# Altium schematic sheet Controller.SchDoc: Controller Section
size 420 x 297 mm; SheetNumber: 2
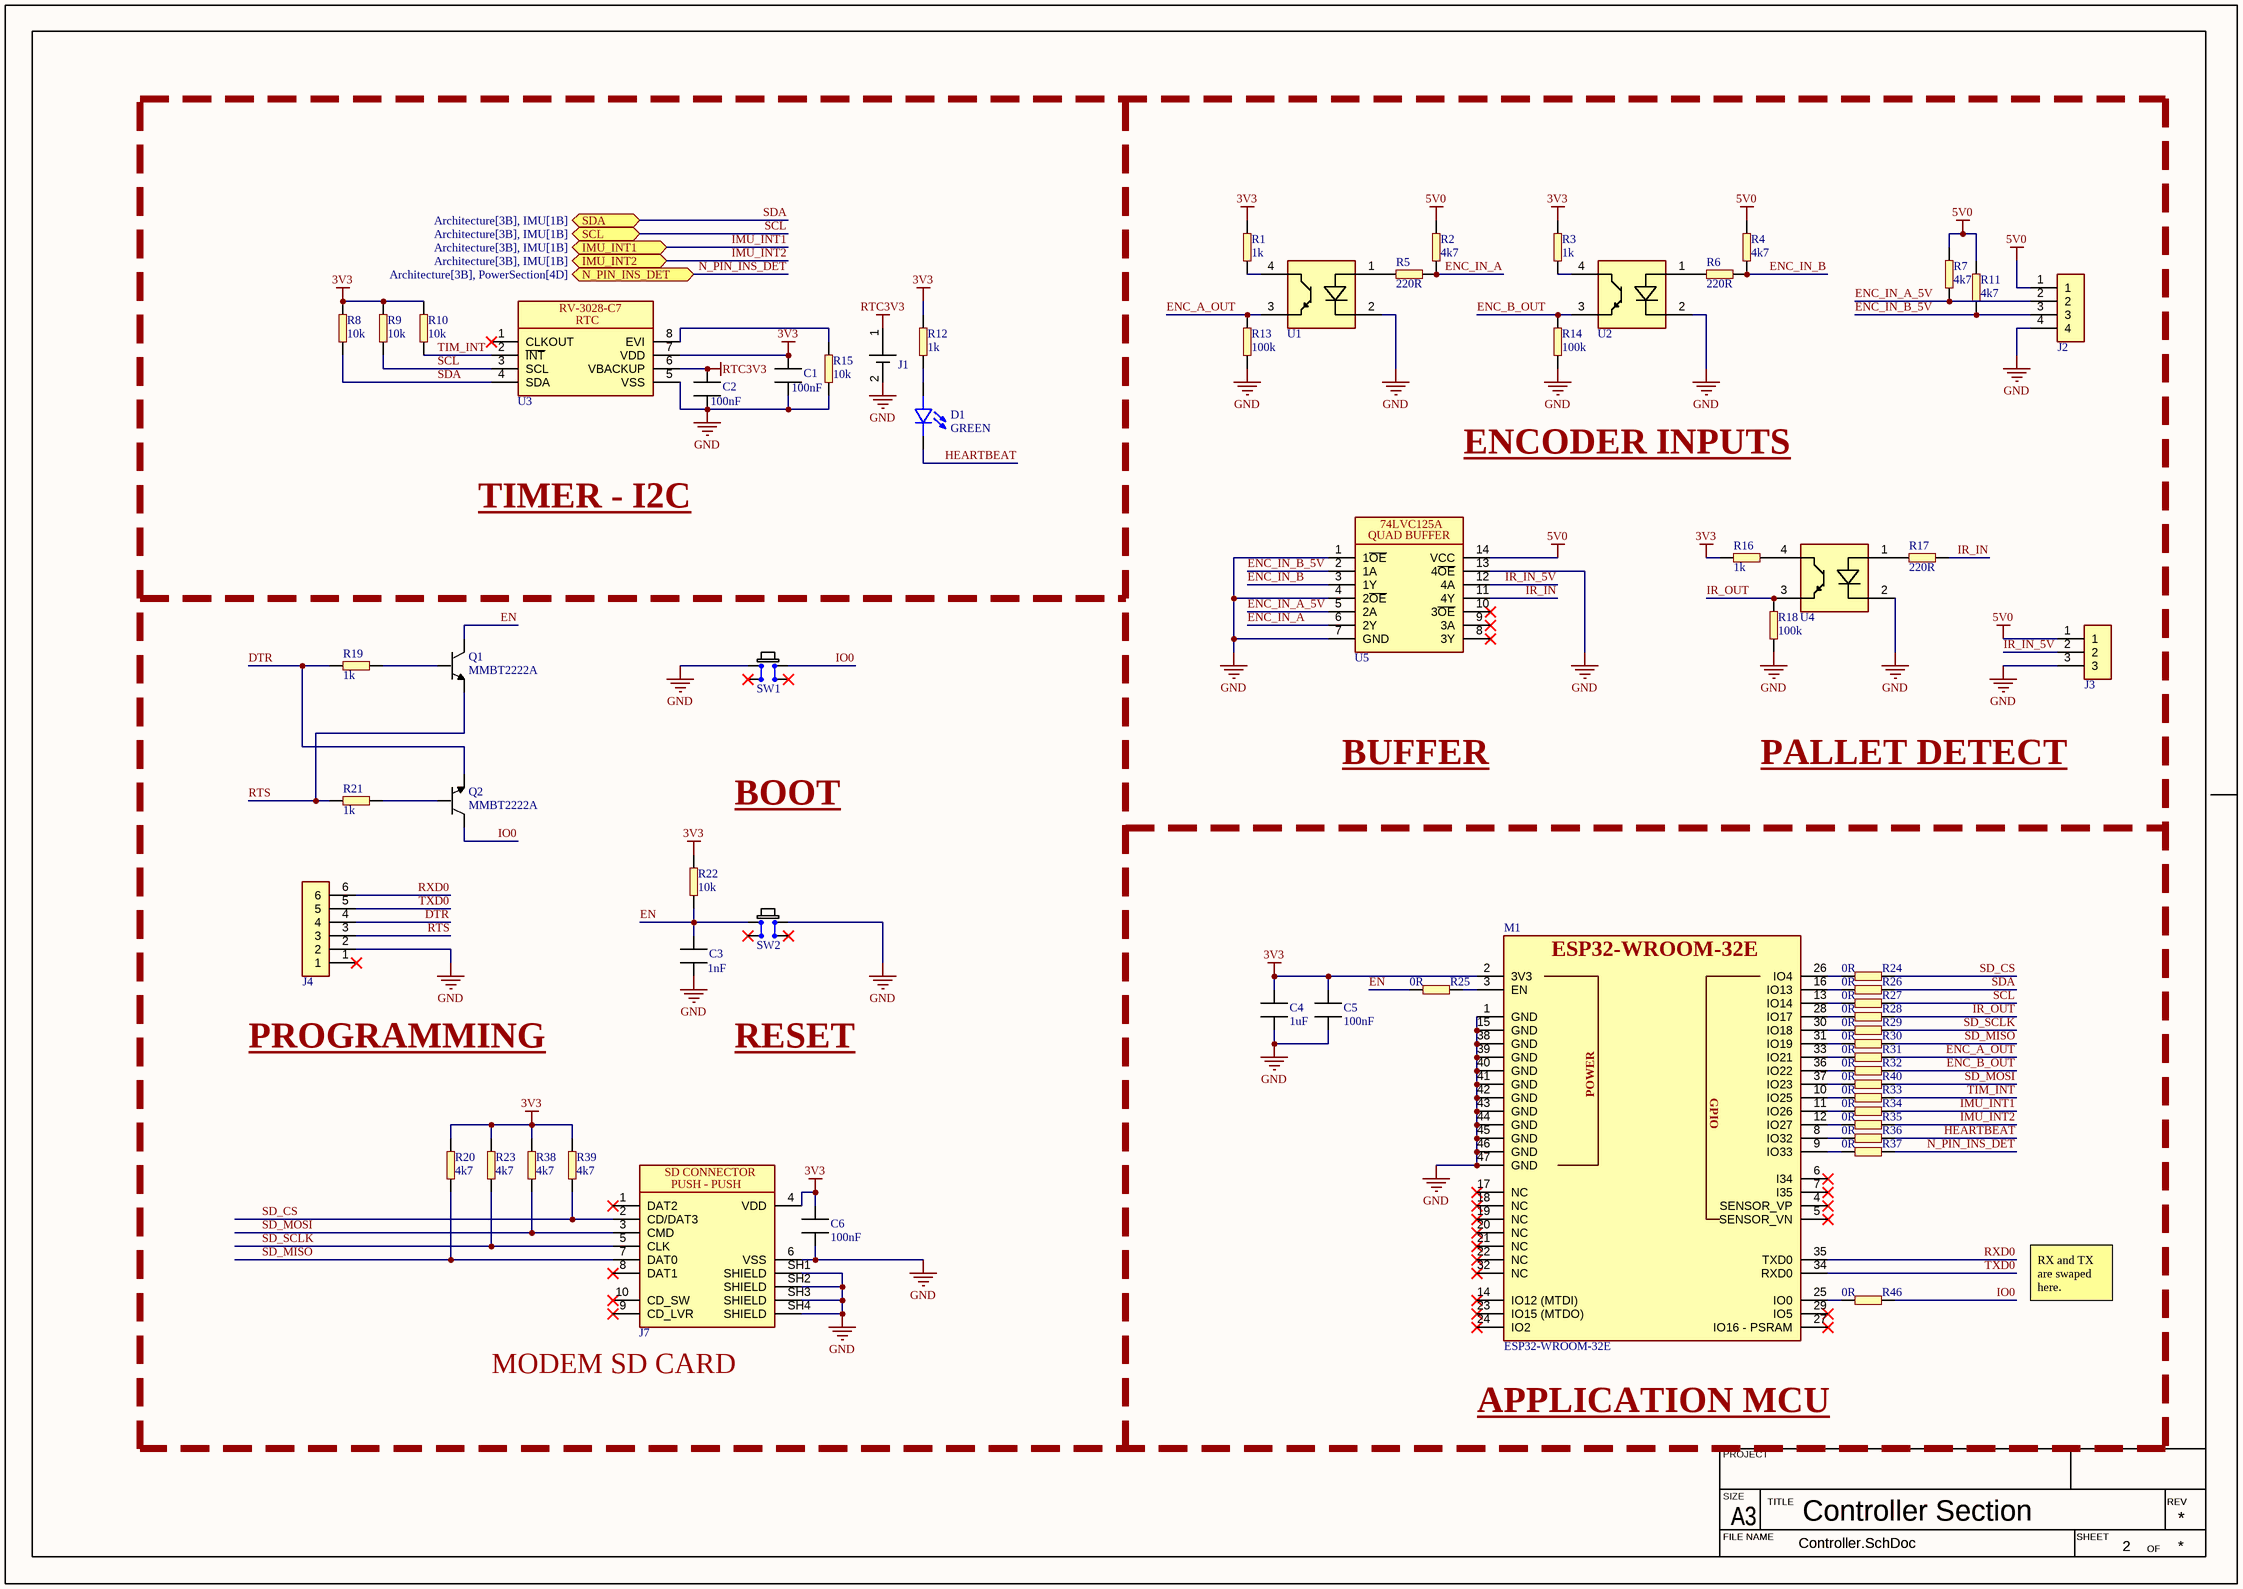
[diagram p0: Controller.SchDoc]

## Parts
C1  value 100nF  [CAPC1608X10N]  (hidden comment: ERP_102-1)
C2  value 100nF  [CAPC1608X10N]  (hidden comment: ERP_102-1)
C3  value 1nF  [CAPC1608X10N]  (hidden comment: ERP_102-1)  (no BOM)
C4  value 1uF  [CAPC1608X10N]  (hidden comment: ERP_102-1)
C5  value 100nF  [CAPC1608X10N]  (hidden comment: ERP_102-1)
C6  value 100nF  [CAPC1608X10N]  (hidden comment: ERP_102-1)
D1  value GREEN  [LED_3MM_GREEN_RIGHT_ANGLE]  (hidden comment: LED_3MM_RIGHT_ANGLE)
J1  CR1220-BH  [CR1220-BH]  (value not drawn)
J2  Terminal_Block_4Pin_5.08P  [TB_PLUG_5.08P_4P]  (value not drawn)
J3  Terminal_Block_3Pin_5.08P  [TB_PLUG_5.08P_3P]  (value not drawn)
J4  ERP_148-2  [6PX1R_F]  (value not drawn)
J7  5033981892  [5033981892]  (value not drawn)
M1  ESP32-WROOM-32E  [ESP32-WROOM-32UE]
Q1  value MMBT2222A  [MMBT2222]  (hidden comment: ERP_105-1)
Q2  value MMBT2222A  [MMBT2222]  (hidden comment: ERP_105-1)
R1  value 1k  [RES_0603]  (hidden comment: ERP_101-1)
R2  value 4k7  [RES_0603]  (hidden comment: ERP_101-1)
R3  value 1k  [RES_0603]  (hidden comment: ERP_101-1)
R4  value 4k7  [RES_0603]  (hidden comment: ERP_101-1)
R5  value 220R  [RES_0603]  (hidden comment: ERP_101-1)
R6  value 220R  [RES_0603]  (hidden comment: ERP_101-1)
R7  value 4k7  [RES_0603]  (hidden comment: ERP_101-1)
R8  value 10k  [RES_0603]  (hidden comment: ERP_101-1)
R9  value 10k  [RES_0603]  (hidden comment: ERP_101-1)
R10  value 10k  [RES_0603]  (hidden comment: ERP_101-1)
R11  value 4k7  [RES_0603]  (hidden comment: ERP_101-1)
R12  value 1k  [RES_0603]  (hidden comment: ERP_101-1)
R13  value 100k  [RES_0603]  (hidden comment: ERP_101-1)
R14  value 100k  [RES_0603]  (hidden comment: ERP_101-1)
R15  value 10k  [RES_0603]  (hidden comment: ERP_101-1)
R16  value 1k  [RES_0603]  (hidden comment: ERP_101-1)
R17  value 220R  [RES_0603]  (hidden comment: ERP_101-1)
R18  value 100k  [RES_0603]  (hidden comment: ERP_101-1)
R19  value 1k  [RES_0603]  (hidden comment: ERP_101-1)
R20  value 4k7  [RES_0603]  (hidden comment: ERP_101-1)
R21  value 1k  [RES_0603]  (hidden comment: ERP_101-1)
R22  value 10k  [RES_0603]  (hidden comment: ERP_101-1)
R23  value 4k7  [RES_0603]  (hidden comment: ERP_101-1)
R24  value 0R  [RES_0603]  (hidden comment: ERP_101-1)
R25  value 0R  [RES_0603]  (hidden comment: ERP_101-1)
R26  value 0R  [RES_0603]  (hidden comment: ERP_101-1)
R27  value 0R  [RES_0603]  (hidden comment: ERP_101-1)
R28  value 0R  [RES_0603]  (hidden comment: ERP_101-1)
R29  value 0R  [RES_0603]  (hidden comment: ERP_101-1)
R30  value 0R  [RES_0603]  (hidden comment: ERP_101-1)
R31  value 0R  [RES_0603]  (hidden comment: ERP_101-1)
R32  value 0R  [RES_0603]  (hidden comment: ERP_101-1)
R33  value 0R  [RES_0603]  (hidden comment: ERP_101-1)
R34  value 0R  [RES_0603]  (hidden comment: ERP_101-1)
R35  value 0R  [RES_0603]  (hidden comment: ERP_101-1)
R36  value 0R  [RES_0603]  (hidden comment: ERP_101-1)
R37  value 0R  [RES_0603]  (hidden comment: ERP_101-1)
R38  value 4k7  [RES_0603]  (hidden comment: ERP_101-1)
R39  value 4k7  [RES_0603]  (hidden comment: ERP_101-1)
R40  value 0R  [RES_0603]  (hidden comment: ERP_101-1)
R46  value 0R  [RES_0603]  (hidden comment: ERP_101-1)
SW1  Generic6X6  [Generic6X6]  (value not drawn)
SW2  Generic6X6  [Generic6X6]  (value not drawn)
U1  FOD817A3SD  [FOD817A3SD]  (value not drawn)
U2  FOD817A3SD  [FOD817A3SD]  (value not drawn)
U3  RV-3028-C7  [RV-3028-C7]  (value not drawn)
U4  FOD817A3SD  [FOD817A3SD]  (value not drawn)
U5  74LVC125A  [SOIC127P600X175-14M]  (value not drawn)

## Ports
IMU_INT1 (bidir, see Architecture[3B], IMU[1B]), IMU_INT2 (bidir, see Architecture[3B], IMU[1B]), N_PIN_INS_DET (bidir, see Architecture[3B], PowerSection[4D]), SCL (bidir, see Architecture[3B], IMU[1B]), SDA (bidir, see Architecture[3B], IMU[1B])

## Nets
3V3: C1.1 C4.2 C5.2 C6.2 J7.4(VDD) M1.2(3V3) R1.2 R3.2 R8.2 R9.2 R10.2 R12.1 R16.2 R20.2 R22.2 R23.2 R38.2 R39.2 U3.7(VDD)
5V0: J2.1 J3.1 R2.2 R4.2 R7.1 R11.1 U5.14(VCC)
GND: C1.2 C2.2 C3.2 C4.1 C5.1 C6.1 J1.2(-) J2.4 J3.3 J4.2 J7.6(VSS) J7.SH1(SHIELD) J7.SH2(SHIELD) J7.SH3(SHIELD) J7.SH4(SHIELD) M1.1(GND) M1.15(GND) M1.38(GND) M1.39(GND) M1.40(GND) M1.41(GND) M1.42(GND) M1.43(GND) M1.44(GND) M1.45(GND) M1.46(GND) M1.47(GND) R13.1 R14.1 R15.1 R18.1 SW1.1(NO) SW2.1(NO) U1.2(CATHODE) U2.2(CATHODE) U3.5(VSS) U4.2(CATHODE) U5.1(1~{OE}) U5.4(2~{OE}) U5.7(GND) U5.13(4~{OE})
RTC3V3: C2.1 J1.1(+) U3.6(VBACKUP)
DTR: J4.4 Q2.2 R19.2
EN: C3.1 Q1.3 R22.1 R25.2 SW2.3(COM)
ENC_A_OUT: R13.2 R31.1 U1.3(EMITTER)
ENC_B_OUT: R14.2 R32.1 U2.3(EMITTER)
ENC_IN_A: R2.1 R5.2 U5.6(2Y)
ENC_IN_A_5V: J2.2 R7.2 U5.5(2A)
ENC_IN_B: R4.1 R6.2 U5.3(1Y)
ENC_IN_B_5V: J2.3 R11.2 U5.2(1A)
HEARTBEAT: D1.2 R36.1
IMU_INT1: R34.1 ; port IMU_INT1
IMU_INT2: R35.2 ; port IMU_INT2
IO0: Q2.3 R46.1 SW1.3(COM)
IR_IN: R17.2 U5.11(4Y)
IR_IN_5V: J3.2 U5.12(4A)
IR_OUT: R18.2 R28.1 U4.3(EMITTER)
N_PIN_INS_DET: R37.1 ; port N_PIN_INS_DET
RTS: J4.3 Q1.2 R21.2
RXD0: J4.6 M1.35(TXD0)
SCL: R9.1 R27.1 U3.3(SCL) ; port SCL
SD_CS: J7.2(CD/DAT3) R24.1 R39.1
SD_MISO: J7.7(DAT0) R20.1 R30.1
SD_MOSI: J7.3(CMD) R38.1 R40.1
SD_SCLK: J7.5(CLK) R23.1 R29.1
SDA: R8.1 R26.1 U3.4(SDA) ; port SDA
TIM_INT: R10.1 R33.1 U3.2(~{INT})
TXD0: J4.5 M1.34(RXD0)
NetD1_1: D1.1 R12.2
NetM1_3: M1.3(EN) R25.1
NetM1_8: M1.8(IO32) R36.2
NetM1_9: M1.9(IO33) R37.2
NetM1_10: M1.10(IO25) R33.2
NetM1_11: M1.11(IO26) R34.2
NetM1_12: M1.12(IO27) R35.1
NetM1_13: M1.13(IO14) R27.2
NetM1_16: M1.16(IO13) R26.2
NetM1_25: M1.25(IO0) R46.2
NetM1_26: M1.26(IO4) R24.2
NetM1_28: M1.28(IO17) R28.2
NetM1_30: M1.30(IO18) R29.2
NetM1_31: M1.31(IO19) R30.2
NetM1_33: M1.33(IO21) R31.2
NetM1_36: M1.36(IO22) R32.2
NetM1_37: M1.37(IO23) R40.2
NetQ1_1: Q1.1 R19.1
NetQ2_1: Q2.1 R21.1
NetR1_1: R1.1 U1.4(COLLECTOR)
NetR3_1: R3.1 U2.4(COLLECTOR)
NetR5_1: R5.1 U1.1(ANODE)
NetR6_1: R6.1 U2.1(ANODE)
NetR15_2: R15.2 U3.8(EVI)
NetR16_1: R16.1 U4.4(COLLECTOR)
NetR17_1: R17.1 U4.1(ANODE)

Not connected (* = marked no-connect by the designer): J4 1*; J7 1(DAT2)* 8(DAT1)* 9(CD_LVR)* 10(CD_SW)*; M1 4(SENSOR_VP)* 5(SENSOR_VN)* 6(I34)* 7(I35)* 14(IO12_(MTDI))* 17(NC)* 18(NC)* 19(NC)* 20(NC)* 21(NC)* 22(NC)* 23(IO15_(MTDO))* 24(IO2)* 27(IO16_-_PSRAM)* 29(IO5)* 32(NC)*; SW1 2(NO)* 4(COM)*; SW2 2(NO)* 4(COM)*; U3 1(CLKOUT)*; U5 8(3Y)* 9(3A)* 10(3~{OE})*

## Notes on the sheet
- ENCODER INPUTS
- TIMER - I2C
- BUFFER
- PALLET DETECT
- BOOT
- PROGRAMMING
- RESET
- RX and TX are swaped here.
- (near J7) MODEM SD CARD
- APPLICATION MCU
- PROJECT
- SIZE
- FILE NAME
- A3
- TITLE
- SHEET
- OF
- REV
- (in symbol 74LVC125A) QUAD BUFFER
- (in symbol 5033981892) SD CONNECTOR; PUSH - PUSH
- (in symbol ESP32-WROOM-32E) POWER; GPIO
- (in symbol RV-3028-C7) RTC

## Library data of the parts
C1 C2 = MLCC_0603: MLCC 0603; Package: 0603; Manufacturer Part Number 1: *; Suuplier Part Number 1: *; ERP: *
  C2: Manufacturer 1: *
C3 = MLCC_0603: MLCC 0603; Manufacturer 1: Samsung Electro-Mechanics; Manufacturer Part Number 1: CL10C102JB8NNNC; Package: 0603; Suuplier Part Number 1: *; ERP: *; Supplier 1: Digikey; Supplier Part Number 1: 1276-1091-1-ND
C4-C6 = MLCC_0603: MLCC 0603; Manufacturer 1: Samsung Electro-Mechanics; Manufacturer Part Number 1: CL10A105KB8NNNC; Package: 0603; Supplier 1: *; Suuplier Part Number 1: *; ERP: *
D1 = LED_3MM_RIGHT_ANGLE: LED_3MM
J1 = CR1220-BH: BATTERY HOLDER COIN 12.5MM SMD; Manufacturer 1: Keystone Electronics; Value: *; Manufacturer Part Number 1: *
J2 = Terminal_Block_4Pin_5.08P: 6PINS TERMINAL BLOCK 5.08 PITCH; Manufacturer Part Number 1: *; Manufacturer 1: *; Supplier Part Number 1: *; Supplier 1: *; ERP: *; Package: 6PIN
J3 = Terminal_Block_3Pin_5.08P: 6PINS TERMINAL BLOCK 5.08 PITCH; Manufacturer Part Number 1: *; Manufacturer 1: *; Supplier Part Number 1: *; Supplier 1: *; ERP: *; Package: 6PIN
J4 = 6PX1R_F: 6PX1R Female Header; Value: *; Manufacturer 1: *; Manufacturer Part Number 1: *
J7 = 5033981892: 9 (8 + 1) Position Card Connector Secure Digital - microSD™ Surface Mount, Right Angle Gold; Manufacturer 1: Molex; Manufacturer Part Number 1: 5033981892; Package: 9 (8+1); Value: *
M1 = ESP32-WROOM-32E: ESP32-WROOM-32E Module; Manufacturer 1: Espressif Systems; Manufacturer Part Number 1: *; Package: *; Value: ESP32-WROOM-32E
Q1 Q2 = MMBT2222: MMBT2222A; Manufacturer Part Number 1: MMBT2222A-7-F; Manufacturer 1: Diotec Semiconductor; ERP: *; Suuplier Part Number 1: *; Supplier 1: *; Package: SOT23
R1-R7 R11 R12 R16 R17 R19 R21 R22 = RES_0603: Manufacturer 1: YAGEO; Manufacturer Part Number 1: RC0603FR-071KL; Package: 0603; ERP: *
R8-R10 R15 R18 R20 R23 R38 R39 = RES_0603: Package: 0603; Manufacturer 1: *; Manufacturer Part Number 1: *
  R8-R10 R15: Supplier 1: *; Supplier Part Number 1: *; ERP: *
  R18: ERP: *
R13 R14 = RES_0603: Manufacturer Part Number 1: RC0603FR-07100KL; Package: 0603; Manufacturer 1: *; ERP: *
R24-R37 R40 R46 = RES_0603: Manufacturer 1: YAGEO; Manufacturer Part Number 1: RC0603JR-07470RL; Package: 0603; ERP: *; Supplier 1: *; Supplier Part Number 1: *; Supplier 2: Digikey; Supplier Part Number 2: 311-470GRCT-ND
SW1 SW2 = Generic6X6: Tactile Switch SPST-NO Top Actuated Surface Mount; Manufacturer Part Number 1: 5558; Manufacturer 1: Sharvi; Package: 6X6
U1 U2 U4 = FOD817A3SD: OPTOISOLATOR 5KV TRANSISTOR 4SMD; Manufacturer: onsemi; Value: *; Manufacturer Part Number 1: FOD817A3SD
U3 = RV-3028-C7: IC RTC CLK/CALENDAR I2C 8SON; Manufacturer 1: Micro Crystal AG; Manufacturer Part Number 1: RV-3028-C7 32.768KHZ 1PPM-TA-QC; Value: *
U5 = 74LVC125A: Buffer, Non-Inverting 4 Element 1 Bit per Element 3-State Output 14-DHVQFN (2.5x3); Manufacturer Part Number 1: ST2103SD1678; Manufacturer 1: Sharvi; Value: *